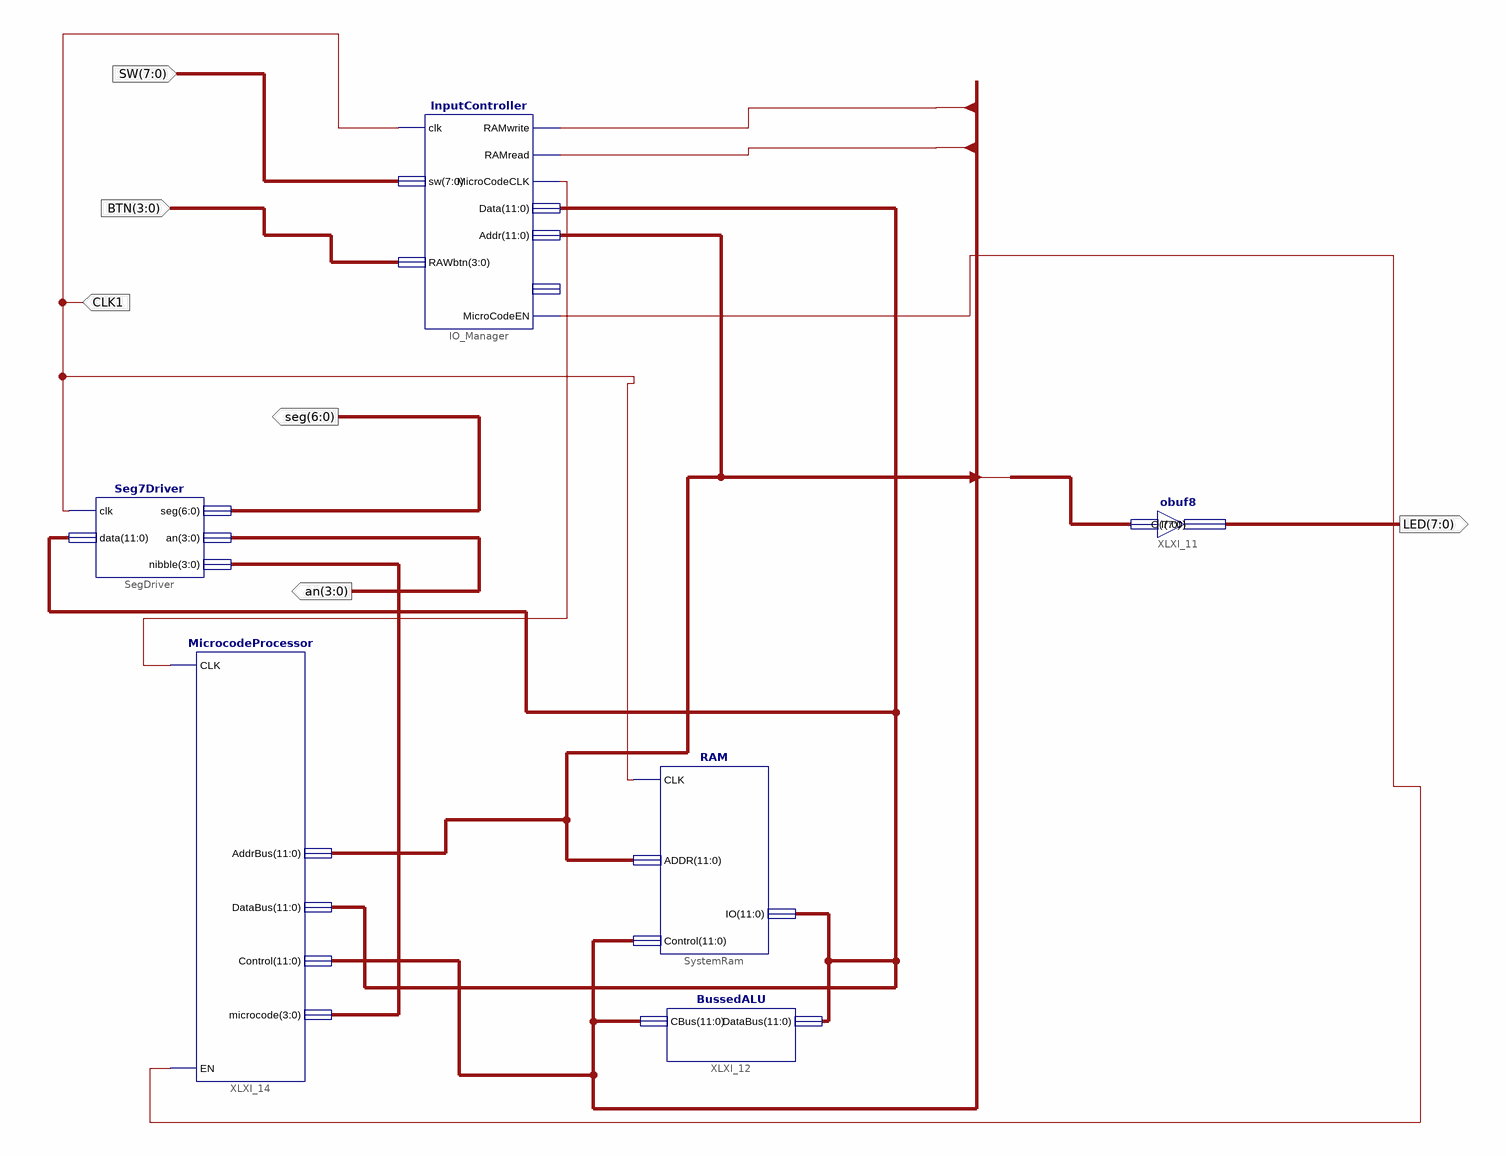
[diagram p0: schematic sheet 1]
// Xilinx ISE schematic TopLevel.sch (spartan3e) as structural Verilog: 6 symbols, 6 ports
module TopLevel (
  input  [3:0] BTN,
  input  [7:0] SW,
  input  CLK1,
  output [6:0] seg,
  output [3:0] an,
  output [7:0] LED
);

  wire XLXN_78, XLXN_104;
  wire [3:0] XLXN_93;
  wire [11:0] ADDR, ControlBus, XLXN_82;

  Seg7Driver SegDriver (.clk(CLK1), .data(XLXN_82), .nibble(XLXN_93), .seg(seg), .an(an));
  InputController IO_Manager (
    .clk(CLK1), .sw(SW), .RAWbtn(BTN), .RAMwrite(ControlBus[1]), .RAMread(ControlBus[0]),
    .MicroCodeCLK(XLXN_78), .Data(XLXN_82), .Addr(ADDR), .MicroCodeEN(XLXN_104));  // open: outNibble
  obuf8 XLXI_11 (.I(ADDR[7:0]), .O(LED));
  RAM SystemRam (.CLK(CLK1), .ADDR(ADDR), .IO(XLXN_82), .Control(ControlBus));
  BussedALU XLXI_12 (.CBus(ControlBus), .DataBus(XLXN_82));
  MicrocodeProcessor XLXI_14 (
    .CLK(XLXN_78), .DataBus(XLXN_82), .microcode(XLXN_93), .AddrBus(ADDR), .Control(ControlBus), .EN(XLXN_104));
endmodule
